# Altium schematic sheet Top.SchDoc
size A
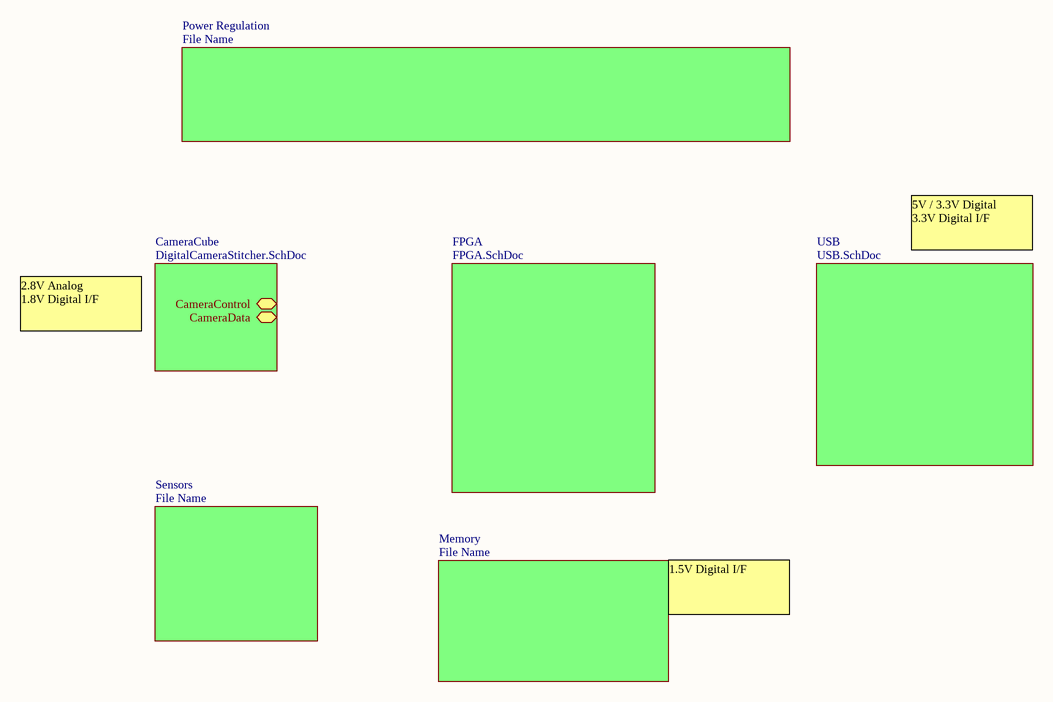
[diagram p0: Top.SchDoc]

## Sub-sheets
CameraCube = DigitalCameraStitcher.SchDoc: CameraControl (harness CameraControlHarness), CameraData (harness CameraDataHarness)
FPGA = FPGA.SchDoc: no entries
Memory = File Name: no entries
Power Regulation = File Name: no entries
Sensors = File Name: no entries
USB = USB.SchDoc: no entries

## Notes on the sheet
- 5V / 3.3V Digital
  3.3V Digital I/F
- 2.8V Analog
  1.8V Digital I/F
- 1.5V Digital I/F